# Altium schematic sheet Interlock.SchDoc
size A3
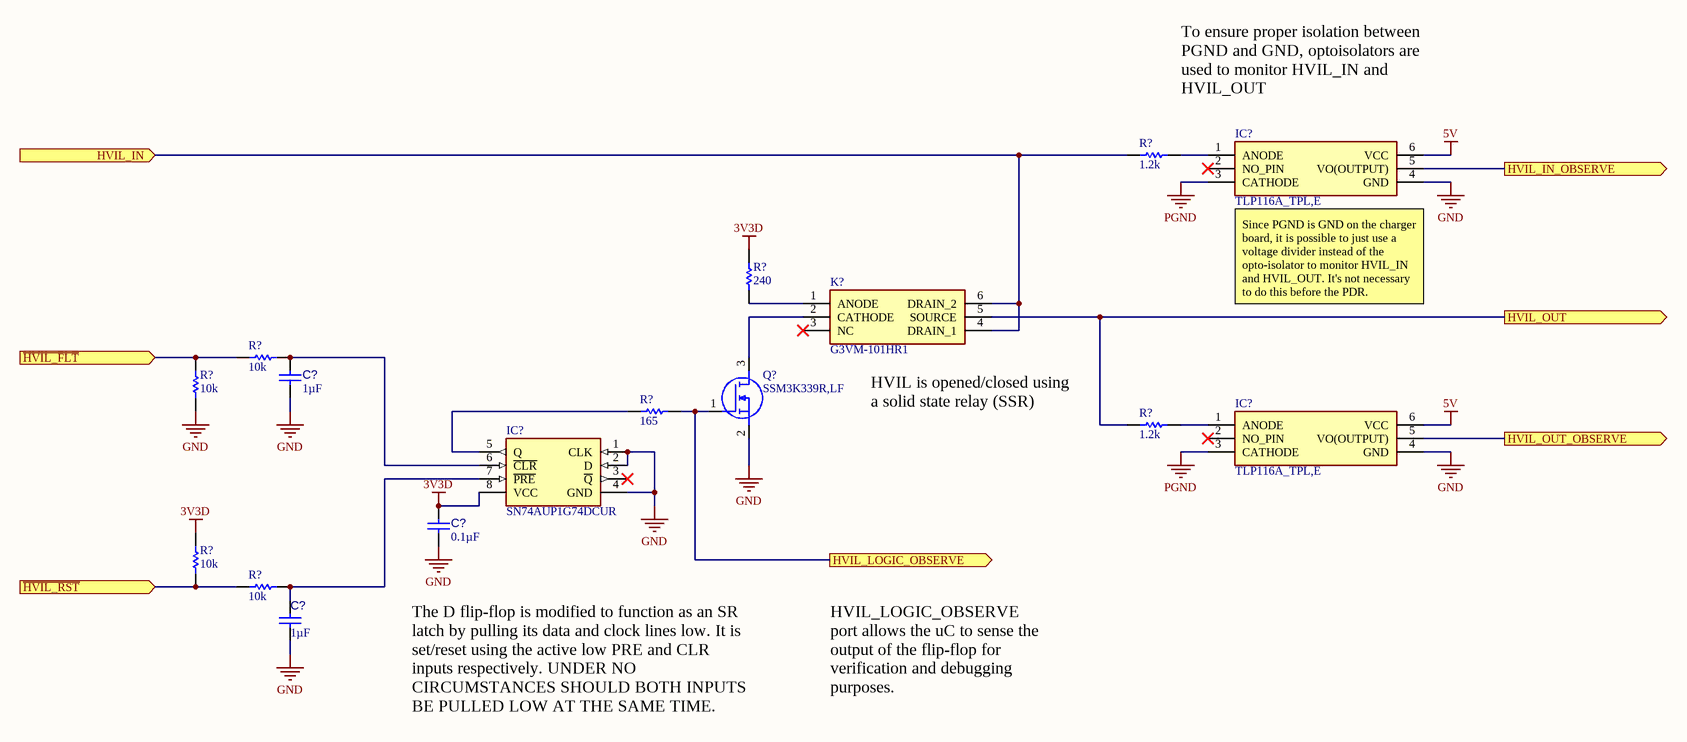
[diagram p0: Interlock.SchDoc]

## Parts
(Parts that share a designator on the sheet are numbered #1, #2 ... from top to bottom, then left to right.)
C?#1  1µF  [CAPC2013X145X50ML20T25]
C?#2  0.1µF  [CAPC2013X145X50ML20T25]
C?#3  1µF  [CAPC2013X145X50ML20T25]
IC?#1  TLP116A_TPL,E  [SOT127P700X230-6N]
IC?#2  TLP116A_TPL,E  [SOT127P700X230-6N]
IC?#3  SN74AUP1G74DCUR  [SOT50P310X90-8N]
K?  G3VM-101HR1  [G3VM101HR1]
Q?  SSM3K339R,LF  [SOTFL95P240X88-3N]
R?#1  1.2k  [RESC2013X50X35ML15T15]
R?#2  240  [RESC2013X50X35ML15T15]
R?#3  10k  [RESC2013X50X35ML15T15]
R?#4  10k  [RESC2013X50X35ML15T15]
R?#5  165  [RESC2013X50X35ML15T15]
R?#6  1.2k  [RESC2013X50X35ML15T15]
R?#7  10k  [RESC2013X50X35ML15T15]
R?#8  10k  [RESC2013X50X35ML15T15]

## Ports
HVIL_IN (in), HVIL_IN_OBSERVE (out), HVIL_LOGIC_OBSERVE (out), HVIL_OUT (out), HVIL_OUT_OBSERVE (out), ~{HVIL_FLT} (in), ~{HVIL_RST} (in)

## Nets
3V3D: C?#2.2 IC?#3.8(VCC) R?#2.1 R?#7.2
5V: IC?#1.6(VCC) IC?#2.6(VCC)
GND: C?#1.2 C?#2.1 C?#3.1 IC?#1.4(GND) IC?#2.4(GND) IC?#3.1(CLK) IC?#3.2(D) IC?#3.4(GND) Q?.2(S) R?#4.1
PGND: IC?#1.3(CATHODE) IC?#2.3(CATHODE)
~{HVIL_FLT}: R?#3.2 R?#4.2 ; port ~{HVIL_FLT}
~{HVIL_RST}: R?#7.1 R?#8.2 ; port ~{HVIL_RST}
HVIL_IN: K?.4(DRAIN_1) K?.6(DRAIN_2) R?#1.1 ; port HVIL_IN
HVIL_IN_OBSERVE: IC?#1.5(VO(OUTPUT)) ; port HVIL_IN_OBSERVE
HVIL_LOGIC_OBSERVE: Q?.1(G) R?#5.2 ; port HVIL_LOGIC_OBSERVE
HVIL_OUT: K?.5(SOURCE) R?#6.1 ; port HVIL_OUT
HVIL_OUT_OBSERVE: IC?#2.5(VO(OUTPUT)) ; port HVIL_OUT_OBSERVE
NetC?#1_1: C?#1.1 IC?#3.6(~{CLR}) R?#3.1
NetC?#3_2: C?#3.2 IC?#3.7(~{PRE}) R?#8.1
NetIC?#1_1: IC?#1.1(ANODE) R?#1.2
NetIC?#2_1: IC?#2.1(ANODE) R?#6.2
NetIC?#3_5: IC?#3.5(Q) R?#5.1
NetK?_1: K?.1(ANODE) R?#2.2
NetK?_2: K?.2(CATHODE) Q?.3(D)

Not connected (* = marked no-connect by the designer): IC?#1 2(NO_PIN)*; IC?#2 2(NO_PIN)*; IC?#3 3(~{Q})*; K? 3(NC)*

## Notes on the sheet
- To ensure proper isolation between PGND and GND, optoisolators are used to monitor HVIL_IN and HVIL_OUT
- (near IC?#1) Since PGND is GND on the charger board, it is possible to just use a voltage divider instead of the opto-isolator to monitor HVIL_IN and HVIL_OUT. It's not necessary to do this before the PDR.
- (near K?) HVIL is opened/closed using a solid state relay (SSR)
- The D flip-flop is modified to function as an SR latch by pulling its data and clock lines low. It is set/reset using the active low PRE and CLR inputs respectively. UNDER NO CIRCUMSTANCES SHOULD BOTH INPUTS BE PULLED LOW AT THE SAME TIME.
- HVIL_LOGIC_OBSERVE port allows the uC to sense the output of the flip-flop for verification and debugging purposes.

## Library data of the parts
C?#1 C?#3 = CMP-001-00010-4: Chip Capacitor, 1 uF, +/-10%, 25 V, 0805 (2012 Metric); Manufacturer: KEMET; Manufacturer Part Number: C0805C105K3RACTU; Dielectric Material: Ceramic; Capacitance: 1uF; Tolerance: 10%; Dielectric: X7R; Voltage: 25V; Value: 1µF; Supplier 1: Digi-Key; Supplier Part Number 1: 399-8004-1-ND; RoHS: Yes; Category: Ceramic Capacitors; Stock 1: 360844; Pricing 1: 1=0.14000, 10=0.10100, 50=0.05720, 100=0.04740, 500=0.03322, 1000=0.02750 (USD); Mount: Surface Mount; Case/Package: 0805; Number of Pins: 2; Contact Plating: Tin,Matte; Case Code (Imperial): 0805; Case Code (Metric): 2012; Min Operating Temperature: -55°C; Max Operating Temperature: 125°C; Packaging: Tape and Reel; Termination: SMD/SMT; Package Quantity: 1; Voltage Rating: 25V; Voltage Rating (DC): 25V; Length: 2mm; Height: 1.25mm; Depth: 1.25mm; Width: 0.049inch; Thickness: 0.055inch; Radiation Hardening: No; REACH SVHC: No SVHC; ComponentLink1URL: https://datasheet.ciiva.com/6074/kem-c1002-x7r-smd-6074661.pdf?src-supplier=Farnell; ComponentLink1Description: https://datasheet.ciiva.com/6074/kem-c1002-x7r-smd-6074661.pdf?src-supplier=Farnell; ComponentLink2URL: https://datasheet.ciiva.com/28610/1918693-28610874.pdf?src-supplier=Element14; ComponentLink2Description: https://datasheet.ciiva.com/28610/1918693-28610874.pdf?src-supplier=Element14; ComponentLink3URL: https://datasheet.ciiva.com/46443/1851736-46443533.pdf?src-supplier=Element14; ComponentLink3Description: https://datasheet.ciiva.com/46443/1851736-46443533.pdf?src-supplier=Element14
C?#2 = CMP-001-00010-4: Chip Capacitor, 0.1 uF, +/-10%, 25 V, 0805 (2012 Metric); Manufacturer: KEMET; Manufacturer Part Number: C0805C104K3RACTU; Dielectric Material: Ceramic; Tolerance: 10%; Capacitance: 100nF; Dielectric: X7R; Voltage: 25V; Value: 0.1µF; Supplier 1: Digi-Key; Supplier Part Number 1: 399-1168-1-ND; RoHS: Yes; Category: Ceramic Capacitors; Stock 1: 417116; Pricing 1: 1=0.14000, 10=0.10000, 50=0.05660, 100=0.04680, 500=0.03284, 1000=0.02719 (USD); Mount: Surface Mount; Case/Package: 0805; Min Operating Temperature: -55°C; Max Operating Temperature: 125°C; Packaging: Tape and Reel; Termination: SMD/SMT; Length: 2mm; Height: 0.9mm; Depth: 1.25mm; Radiation Hardening: No; ComponentLink1URL: https://datasheet.ciiva.com/18193/getdatasheetpartid-385649-18193413.pdf?src-supplier=Verical; ComponentLink1Description: https://datasheet.ciiva.com/18193/getdatasheetpartid-385649-18193413.pdf?src-supplier=Verical; ComponentLink2URL: https://datasheet.ciiva.com/7842/kem-c1002-x7r-smd-7842536.pdf?src-supplier=Element14; ComponentLink2Description: https://datasheet.ciiva.com/7842/kem-c1002-x7r-smd-7842536.pdf?src-supplier=Element14; ComponentLink3URL: https://datasheet.ciiva.com/7842/kem-c1002-x7r-smd-7842538.pdf?src-supplier=Element14; ComponentLink3Description: https://datasheet.ciiva.com/7842/kem-c1002-x7r-smd-7842538.pdf?src-supplier=Element14
IC?#1 IC?#2 = TLP116A_TPL,E: Integrated Circuit; Manufacturer_Name: Toshiba; Manufacturer_Part_Number: TLP116A(TPL,E; Datasheet Link: https://media.digikey.com/pdf/Data%20Sheets/Toshiba%20PDFs/TLP116A.pdf; Height: 2.3mm; Arrow Part Number: TLP116A(TPL,E; Arrow Price/Stock: https://www.arrow.com/en/products/tlp116a-tple/toshiba; Mouser Part Number: 757-TLP116A(TPLE; Mouser Price/Stock: https://www.mouser.co.uk/ProductDetail/Toshiba/TLP116ATPLE?qs=HVbQlW5zcXWPuFTVF%252BZ0qw%3D%3D
IC?#3 = SN74AUP1G74DCUR: Integrated Circuit; Manufacturer_Name: Texas Instruments; Datasheet Link: http://www.ti.com/lit/gpn/sn74aup1g74; Height: 0.9mm; Manufacturer_Part_Number: SN74AUP1G74DCUR; Arrow Part Number: SN74AUP1G74DCUR; Arrow Price/Stock: https://www.arrow.com/en/products/sn74aup1g74dcur/texas-instruments; Mouser Part Number: 595-SN74AUP1G74DCUR; Mouser Price/Stock: https://www.mouser.co.uk/ProductDetail/Texas-Instruments/SN74AUP1G74DCUR?qs=7kv20MEVUlht0wF4P3v%252Bhg%3D%3D
K? = G3VM-101HR1: Relay or Contactor; Manufacturer_Name: Omron Electronics; Datasheet Link: https://componentsearchengine.com/Datasheets/1/G3VM-101HR1.pdf; Height: 2.1mm; Manufacturer_Part_Number: G3VM-101HR1; Arrow Part Number: G3VM-101HR1; Arrow Price/Stock: https://www.arrow.com/en/products/g3vm-101hr1/omron; Mouser Part Number: 653-G3VM-101HR1; Mouser Price/Stock: https://www.mouser.com/Search/Refine.aspx?Keyword=653-G3VM-101HR1
Q? = SSM3K339R,LF: MOSFET (N-Channel); Manufacturer_Name: Toshiba; Datasheet Link: https://www.arrow.com/en/products/ssm3k339rlf/toshiba; Height: 0.88mm; Manufacturer_Part_Number: SSM3K339R,LF; Arrow Part Number: SSM3K339R,LF; Arrow Price/Stock: https://www.arrow.com/en/products/ssm3k339rlf/toshiba; Mouser Part Number: 757-SSM3K339RLF; Mouser Price/Stock: https://www.mouser.co.uk/ProductDetail/Toshiba/SSM3K339RLF?qs=vPP9GyyTAo2h4IM%252B%252BLvR%252BA%3D%3D
R?#1 R?#6 = CMP-009-00001-4: Chip Resistor, 1.2k Ohm, +/- 1%, 125 mW, -55 to 155 degC, 0805 (2012 Metric); Manufacturer: TE Connectivity; Manufacturer Part Number: CRGCQ0805F1K2; Resistance: 1.2kR; Max Power Dissipation: 125mW; Temperature Coefficient: 100ppm/°C; Value: 1.2k; Supplier 1: Digi-Key; Supplier Part Number 1: A129750CT-ND; RoHS: No; Category: Chip SMD Resistors; Stock 1: 34317; Pricing 1: 1=0.10000, 10=0.04700, 100=0.01890, 1000=0.00851, 2500=0.00738 (USD); Case/Package: 0805; Min Operating Temperature: -55°C; Max Operating Temperature: 155°C; Composition: Thick Film; Features: Moisture Resistant,Automotive AEC-Q200; Packaging: Cut Tape; Tolerance: 1%; Number of Terminations: 2; ComponentLink1URL: https://4donline.ihs.com/images/VipMasterIC/IC/TYEL/TYEL-S-A0004929575/TYEL-S-A0004929575-1.pdf?hkey=52A5661711E402568146F3353EA87419&src-supplier=Newark; ComponentLink1Description: https://4donline.ihs.com/images/VipMasterIC/IC/TYEL/TYEL-S-A0004929575/TYEL-S-A0004929575-1.pdf?hkey=52A5661711E402568146F3353EA87419&src-supplier=Newark; ComponentLink2URL: https://4donline.ihs.com/images/VipMasterIC/IC/TYEL/TYEL-S-A0004929575/TYEL-S-A0004929575-1.pdf?hkey=52A5661711E402568146F3353EA87419&src-supplier=Farnell; ComponentLink2Description: https://4donline.ihs.com/images/VipMasterIC/IC/TYEL/TYEL-S-A0004929575/TYEL-S-A0004929575-1.pdf?hkey=52A5661711E402568146F3353EA87419&src-supplier=Farnell; ComponentLink3URL: https://www.te.com/commerce/DocumentDelivery/DDEController?Action=srchrtrv&DocNm=1773204-3&DocType=DS&DocLang=English&src-supplier=Digi-Key; ComponentLink3Description: https://www.te.com/commerce/DocumentDelivery/DDEController?Action=srchrtrv&DocNm=1773204-3&DocType=DS&DocLang=English&src-supplier=Digi-Key
R?#2 = CMP-009-00001-4: Chip Resistor, 240 Ohm, +/- 1%, 125 mW, -55 to 155 degC, 0805 (2012 Metric); Manufacturer: Panasonic; Manufacturer Part Number: ERA-6AEB241V; Resistance: 240R; Power Rating: 125mW; Tolerance: 0.1%; Voltage Rating: 100V; Temperature Coefficient: 25ppm/°C; Value: 240; Supplier 1: Digi-Key; Supplier Part Number 1: P240DACT-ND; RoHS: Yes; Category: Chip SMD Resistors; Stock 1: 12724; Pricing 1: 1=0.33000, 10=0.27800, 100=0.10850, 1000=0.04541, 2500=0.04163 (USD); Mount: Surface Mount; Case/Package: 0805; Number of Pins: 2; Case Code (Metric): 2012; Case Code (Imperial): 0805; Contact Plating: Tin; Min Operating Temperature: -55°C; Max Operating Temperature: 155°C; Packaging: Tape and Reel; Package Quantity: 1; Composition: Thin Film; Number of Terminations: 2; Military Standard: Not; Termination: Solder; Max Power Dissipation: 125mW; Voltage Rating (DC): 100V; Features: Automotive AEC-Q200; Length: 2mm; Height: 0.5mm; Width: 1.25mm; Depth: 1.25mm; Radiation Hardening: No; REACH SVHC: No SVHC; Lead Free: Lead Free; ComponentLink1URL: https://datasheet.ciiva.com/29184/452815-da-01-en-widerstand-0805-era-29184072.pdf?src-supplier=Conrad; ComponentLink1Description: https://datasheet.ciiva.com/29184/452815-da-01-en-widerstand-0805-era-29184072.pdf?src-supplier=Conrad; ComponentLink2URL: https://datasheet.ciiva.com/5915/485442-5915205.pdf?src-supplier=Farnell; ComponentLink2Description: https://datasheet.ciiva.com/5915/485442-5915205.pdf?src-supplier=Farnell; ComponentLink3URL: https://datasheet.ciiva.com/43455/485442-43455397.pdf?src-supplier=Farnell; ComponentLink3Description: https://datasheet.ciiva.com/43455/485442-43455397.pdf?src-supplier=Farnell; ComponentLink4URL: https://datasheet.ciiva.com/30154/54aoa0000ce26-30154486.pdf?src-supplier=Onlinecomponents.com; ComponentLink4Description: https://datasheet.ciiva.com/30154/54aoa0000ce26-30154486.pdf?src-supplier=Onlinecomponents.com; ComponentLink5URL: https://datasheet.ciiva.com/48425/era-eng-tds-48425782.pdf?src-supplier=Distrelec; ComponentLink5Description: https://datasheet.ciiva.com/48425/era-eng-tds-48425782.pdf?src-supplier=Distrelec; ComponentLink6URL: https://datasheet.ciiva.com/5915/485442-5915208.pdf?src-supplier=Farnell; ComponentLink6Description: https://datasheet.ciiva.com/5915/485442-5915208.pdf?src-supplier=Farnell; ComponentLink7URL: https://datasheet.ciiva.com/46389/485442-46389960.pdf?src-supplier=Element14; ComponentLink7Description: https://datasheet.ciiva.com/46389/485442-46389960.pdf?src-supplier=Element14; ComponentLink8URL: https://datasheet.ciiva.com/46389/485442-46389961.pdf?src-supplier=Element14; ComponentLink8Description: https://datasheet.ciiva.com/46389/485442-46389961.pdf?src-supplier=Element14; ComponentLink9URL: https://datasheet.ciiva.com/48536/era-eng-tds-48536634.pdf?src-supplier=Distrelec; ComponentLink9Description: https://datasheet.ciiva.com/48536/era-eng-tds-48536634.pdf?src-supplier=Distrelec; ComponentLink10URL: https://datasheet.ciiva.com/22739/485442-22739483.pdf?src-supplier=Element14; ComponentLink10Description: https://datasheet.ciiva.com/22739/485442-22739483.pdf?src-supplier=Element14; ComponentLink11URL: https://datasheet.ciiva.com/17206/aoa0000ce26-17206700.pdf?src-supplier=Avnet+Europe; ComponentLink11Description: https://datasheet.ciiva.com/17206/aoa0000ce26-17206700.pdf?src-supplier=Avnet+Europe; ComponentLink12URL: https://datasheet.ciiva.com/43457/485442-43457869.pdf?src-supplier=Farnell; ComponentLink12Description: https://datasheet.ciiva.com/43457/485442-43457869.pdf?src-supplier=Farnell
R?#3 R?#7 R?#8 = CMP-009-00001-4: Chip Resistor, 10k Ohm, +/- 1%, 125 mW, -55 to 155 degC, 0805 (2012 Metric); Manufacturer: Yageo; Manufacturer Part Number: RC0805FR-0710KL; Resistance: 10kR; Temperature Coefficient: 100ppm/°C; Power Rating: 125mW; Voltage Rating: 150V; Value: 10k; Supplier 1: Digi-Key; Supplier Part Number 1: 311-10.0KCRCT-ND; RoHS: Yes; Category: Chip SMD Resistors; Stock 1: 19063106; Pricing 1: 1=0.10000, 10=0.03900, 100=0.01570, 1000=0.00705, 2500=0.00612 (USD); Case/Package: 0805; Case Code (Imperial): 0805; Case Code (Metric): 2012; Min Operating Temperature: -55°C; Max Operating Temperature: 155°C; Packaging: Tape and Reel; Tolerance: 1%; Composition: Thick Film; Package Quantity: 1; Termination: SMD/SMT; Number of Terminations: 2; Military Standard: Not; Max Power Dissipation: 125mW; Features: Moisture Resistant; Length: 2mm; Height: 0.024inch; Width: 0.049inch; Depth: 1.25mm; REACH SVHC: Unknown; Lead Free: Lead Free; ComponentLink1URL: https://datasheet.ciiva.com/11808/0900766b8106beab-11808151.pdf?src-supplier=RSComponents; ComponentLink1Description: https://datasheet.ciiva.com/11808/0900766b8106beab-11808151.pdf?src-supplier=RSComponents; ComponentLink2URL: https://datasheet.ciiva.com/12669/rc0805-12669688.pdf?src-supplier=Mouser; ComponentLink2Description: https://datasheet.ciiva.com/12669/rc0805-12669688.pdf?src-supplier=Mouser; ComponentLink3URL: https://datasheet.ciiva.com/46447/444164-46447563.pdf?src-supplier=Element14; ComponentLink3Description: https://datasheet.ciiva.com/46447/444164-46447563.pdf?src-supplier=Element14; ComponentLink4URL: https://datasheet.ciiva.com/2456/pyu-r-int-thick-7-2456972.pdf?src-supplier=Digi-Key; ComponentLink4Description: https://datasheet.ciiva.com/2456/pyu-r-int-thick-7-2456972.pdf?src-supplier=Digi-Key; ComponentLink5URL: https://datasheet.ciiva.com/2456/pyu-r-int-thick-7-2456973.pdf?src-supplier=Digi-Key; ComponentLink5Description: https://datasheet.ciiva.com/2456/pyu-r-int-thick-7-2456973.pdf?src-supplier=Digi-Key; ComponentLink6URL: https://datasheet.ciiva.com/2456/pyu-r-int-thick-7-2456974.pdf?src-supplier=Digi-Key; ComponentLink6Description: https://datasheet.ciiva.com/2456/pyu-r-int-thick-7-2456974.pdf?src-supplier=Digi-Key; ComponentLink7URL: https://datasheet.ciiva.com/16747/rc0805-16747087.pdf?src-supplier=Future+Electronics; ComponentLink7Description: https://datasheet.ciiva.com/16747/rc0805-16747087.pdf?src-supplier=Future+Electronics
R?#4 = CMP-009-00001-4: Chip Resistor, 1.2k Ohm, +/- 1%, 125 mW, -55 to 155 degC, 0805 (2012 Metric); Manufacturer: Yageo; Manufacturer Part Number: RC0805FR-0710KL; Resistance: 10kR; Temperature Coefficient: 100ppm/°C; Power Rating: 125mW; Voltage Rating: 150V; Value: 10k; Supplier 1: Digi-Key; Supplier Part Number 1: 311-10.0KCRCT-ND; RoHS: Yes; Category: Chip SMD Resistors; Stock 1: 19063106; Pricing 1: 1=0.10000, 10=0.03900, 100=0.01570, 1000=0.00705, 2500=0.00612 (USD); Case/Package: 0805; Case Code (Imperial): 0805; Case Code (Metric): 2012; Min Operating Temperature: -55°C; Max Operating Temperature: 155°C; Packaging: Tape and Reel; Tolerance: 1%; Composition: Thick Film; Package Quantity: 1; Termination: SMD/SMT; Number of Terminations: 2; Military Standard: Not; Max Power Dissipation: 125mW; Features: Moisture Resistant; Length: 2mm; Height: 0.024inch; Width: 0.049inch; Depth: 1.25mm; REACH SVHC: Unknown; Lead Free: Lead Free; ComponentLink1URL: https://datasheet.ciiva.com/11808/0900766b8106beab-11808151.pdf?src-supplier=RSComponents; ComponentLink1Description: https://datasheet.ciiva.com/11808/0900766b8106beab-11808151.pdf?src-supplier=RSComponents; ComponentLink2URL: https://datasheet.ciiva.com/12669/rc0805-12669688.pdf?src-supplier=Mouser; ComponentLink2Description: https://datasheet.ciiva.com/12669/rc0805-12669688.pdf?src-supplier=Mouser; ComponentLink3URL: https://datasheet.ciiva.com/46447/444164-46447563.pdf?src-supplier=Element14; ComponentLink3Description: https://datasheet.ciiva.com/46447/444164-46447563.pdf?src-supplier=Element14; ComponentLink4URL: https://datasheet.ciiva.com/2456/pyu-r-int-thick-7-2456972.pdf?src-supplier=Digi-Key; ComponentLink4Description: https://datasheet.ciiva.com/2456/pyu-r-int-thick-7-2456972.pdf?src-supplier=Digi-Key; ComponentLink5URL: https://datasheet.ciiva.com/2456/pyu-r-int-thick-7-2456973.pdf?src-supplier=Digi-Key; ComponentLink5Description: https://datasheet.ciiva.com/2456/pyu-r-int-thick-7-2456973.pdf?src-supplier=Digi-Key; ComponentLink6URL: https://datasheet.ciiva.com/2456/pyu-r-int-thick-7-2456974.pdf?src-supplier=Digi-Key; ComponentLink6Description: https://datasheet.ciiva.com/2456/pyu-r-int-thick-7-2456974.pdf?src-supplier=Digi-Key; ComponentLink7URL: https://datasheet.ciiva.com/16747/rc0805-16747087.pdf?src-supplier=Future+Electronics; ComponentLink7Description: https://datasheet.ciiva.com/16747/rc0805-16747087.pdf?src-supplier=Future+Electronics
R?#5 = CMP-009-00001-4: Chip Resistor, 165 Ohm, +/- 1%, 125 mW, -55 to 155 degC, 0805 (2012 Metric); Manufacturer: Panasonic; Manufacturer Part Number: ERA-6AEB1650V; Power Rating: 125mW; Tolerance: 0.1%; Voltage Rating: 100V; Resistance: 165R; Temperature Coefficient: 25ppm/°C; Value: 165; Supplier 1: Digi-Key; Supplier Part Number 1: P165DACT-ND; RoHS: Yes; Category: Chip SMD Resistors; Stock 1: 7632; Pricing 1: 1=0.33000, 10=0.27800, 100=0.10850, 1000=0.04541, 2500=0.04163 (USD); Mount: Surface Mount; Case/Package: 0805; Number of Pins: 2; Case Code (Imperial): 0805; Case Code (Metric): 2012; Contact Plating: Tin; Min Operating Temperature: -55°C; Max Operating Temperature: 155°C; Packaging: Tape and Reel; Composition: Metal Film,Thin Film; Features: Automotive AEC-Q200; Voltage Rating (DC): 100V; Number of Terminations: 2; Termination: Solder; Package Quantity: 1; Max Power Dissipation: 125mW; Length: 2mm; Height: 0.5mm; Width: 1.25mm; Depth: 1.25mm; Radiation Hardening: No; Lead Free: Lead Free; ComponentLink1URL: https://datasheet.ciiva.com/11815/0900766b80eb1d8c-11815736.pdf?src-supplier=RSComponents; ComponentLink1Description: https://datasheet.ciiva.com/11815/0900766b80eb1d8c-11815736.pdf?src-supplier=RSComponents; ComponentLink2URL: https://datasheet.ciiva.com/41450/001181180-da-01-en-widerstand-era-0805-165r-0-1-5000st-41450340.pdf?src-supplier=Conrad; ComponentLink2Description: https://datasheet.ciiva.com/41450/001181180-da-01-en-widerstand-era-0805-165r-0-1-5000st-41450340.pdf?src-supplier=Conrad; ComponentLink3URL: https://datasheet.ciiva.com/5950/485442-5950985.pdf?src-supplier=Farnell; ComponentLink3Description: https://datasheet.ciiva.com/5950/485442-5950985.pdf?src-supplier=Farnell; ComponentLink4URL: https://datasheet.ciiva.com/17207/aoa0000ce26-17207273.pdf?src-supplier=Avnet+Europe; ComponentLink4Description: https://datasheet.ciiva.com/17207/aoa0000ce26-17207273.pdf?src-supplier=Avnet+Europe; ComponentLink5URL: https://datasheet.ciiva.com/7942/485442-7942219.pdf?src-supplier=Element14; ComponentLink5Description: https://datasheet.ciiva.com/7942/485442-7942219.pdf?src-supplier=Element14; ComponentLink6URL: https://datasheet.ciiva.com/9185/aoa0000ce26-9185164.pdf?src-supplier=Avnet; ComponentLink6Description: https://datasheet.ciiva.com/9185/aoa0000ce26-9185164.pdf?src-supplier=Avnet; ComponentLink7URL: https://datasheet.ciiva.com/5950/485442-5950981.pdf?src-supplier=Farnell; ComponentLink7Description: https://datasheet.ciiva.com/5950/485442-5950981.pdf?src-supplier=Farnell; ComponentLink8URL: https://datasheet.ciiva.com/7942/485442-7942220.pdf?src-supplier=Element14; ComponentLink8Description: https://datasheet.ciiva.com/7942/485442-7942220.pdf?src-supplier=Element14